# Altium schematic sheet DCT.SchDoc
size A3; SheetNumber: 1; SheetTotal: 1
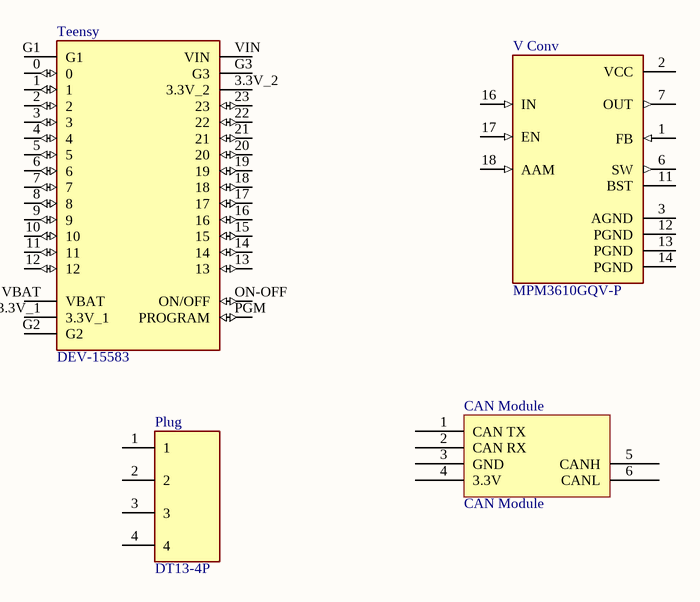
[diagram p0: DCT.SchDoc]

## Parts
CAN_Module  CAN Module  [CAN Module-Footprint-1]
Plug  DT13-4P  [TE_DT13-4P]
Teensy  DEV-15583  [MODULE_DEV-15583]
V_Conv  MPM3610GQV-P  [CONV_MPM3610GQV-P]

## Nets

Not connected (* = marked no-connect by the designer): CAN_Module 1(CAN_TX) 2(CAN_RX) 3(GND) 4(3.3V) 5(CANH) 6(CANL); Plug 1 2 3 4; Teensy 0 1 2 3 3.3V_1 3.3V_2 4 5 6 7 8 9 10 11 12 13 14 15 16 17 18 19 20 21 22 23 G1 G2 G3 ON-OFF(ON/OFF) PGM(PROGRAM) VBAT VIN; V_Conv 1(FB) 2(VCC) 3(AGND) 6(SW) 7(OUT) 11(BST) 12(PGND) 13(PGND) 14(PGND) 16(IN) 17(EN) 18(AAM)

## Library data of the parts
CAN_Module = CMP-00030-00003-1: CAN waveshare
Plug = DT13-4P: DT13 Series, 4.44mm Pitch 4 Way 2 Row Right Angle PCB Header, Solder Termination; MF: TE Connectivity; SnapEDA_Link: https://www.snapeda.com/parts/DT13-4P/TE%20Connectivity%20Deutsch%20Connectors/view-part/2708791/?ref=snap; MP: DT13-4P; TE_purchase_URL: https://www.te.com/usa-en/product-DT13-4P.html?te_bu=Cor&te_type=disp&te_campaign=seda_glo_cor-seda-global-disp-prtnr-fy19-seda-model-bom-cta_sma-317_1&elqCampaignId=32493; Availability: Unavailable; Value: *; Price: None; Package: None
Teensy = DEV-15583: RT1062 Teensy 4.0 i.MX ARMÂ® CortexÂ®-M7 MPU Embedded Evaluation Board; MF: SparkFun Electronics; Value: *; Package: None; Digi-Key_Part_Number: 1568-DEV-15583-ND; Digi-Key_Purchase_URL: https://www.digikey.com/product-detail/en/sparkfun-electronics/DEV-15583/1568-DEV-15583-ND/10384551?utm_source=snapeda&utm_medium=aggregator&utm_campaign=symbol; MP: DEV-15583; SnapEDA_Link: https://www.snapeda.com/parts/DEV-15583/SparkFun%20Electronics/view-part/4001229/?ref=snap
V_Conv = MPM3610GQV-P: Non-Isolated PoL Module DC DC Converter 1 Output 0.8 ~ 18.48V - - 1.2A 4.5V - 21V Input; MF: Monolithic Power; Package: QFN-20 MPS; Price: None; Check_prices: https://www.snapeda.com/parts/MPM3610GQV-P/Monolithic+Power+Systems+Inc./view-part/?ref=eda; Value: *; SnapEDA_Link: https://www.snapeda.com/parts/MPM3610GQV-P/Monolithic+Power+Systems+Inc./view-part/?ref=snap; MP: MPM3610GQV-P; Availability: In Stock; Purchase-URL: https://pricing.snapeda.com/search?q=MPM3610GQV-P&ref=eda